# Altium schematic sheet MINIBLDC.SchDoc
size A4
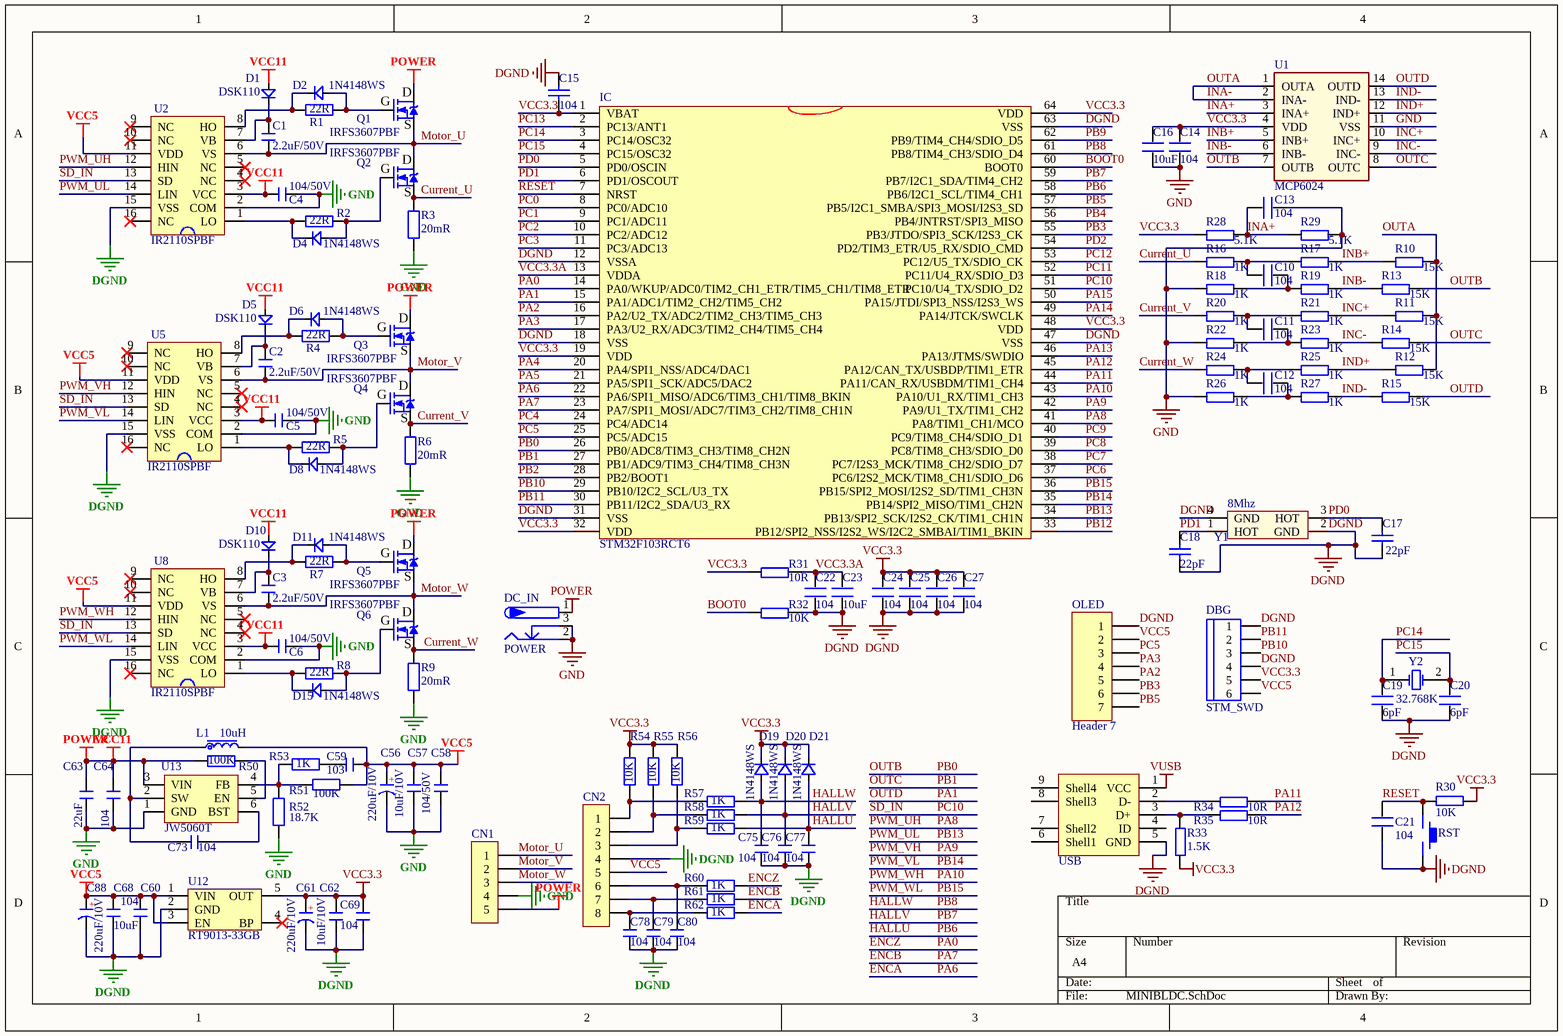
[diagram p0: MINIBLDC.SchDoc]

## Parts
C1  2.2uF/50V  [C 0603]
C2  2.2uF/50V  [C 0603]
C3  2.2uF/50V  [C 0603]
C4  104/50V  [C 0603]
C5  104/50V  [C 0603]
C6  104/50V  [C 0603]
C10  104  [C 0603]
C11  104  [C 0603]
C12  104  [C 0603]
C13  104  [C 0603]
C14  104  [C 0603]
C15  104  [C 0603]
C16  10uF  [C 0603]
C17  22pF  [C 0603]
C18  22pF  [C 0603]
C19  6pF  [C 0603]
C20  6pF  [C 0603]
C21  104  [C 0603]
C22  104  [C 0603]
C23  10uF  [C 0603]
C24  104  [C 0603]
C25  104  [C 0603]
C26  104  [C 0603]
C27  104  [C 0603]
C56  220uF/10V  [CM D(6.3*5.4)]
C57  10uF/10V  [C 0603]
C58  104/50V  [C 0603]
C59  103  [C 0603]
C60  104  [C 0603]
C61  220uF/10V  [CM D(6.3*5.4)]
C62  10uF/10V  [C 0603]
C63  22uF  [C 0805]
C64  104  [C 0603]
C68  10uF  [C 0603]
C69  104  [C 0603]
C73  104  [C 0603]
C75  104  [C 0603]
C76  104  [C 0603]
C77  104  [C 0603]
C78  104  [C 0603]
C79  104  [C 0603]
C80  104  [C 0603]
C88  220uF/10V  [CM D(6.3*5.4)]
CN1  HDR-1X5  [KF7620-5P]  (value not drawn)
CN2  HDR-1X8  [HDR2.54-LI-8P]  (value not drawn)
D1  DSK110  [SOD-123F]
D2  1N4148WS  [SOD-323]
D4  1N4148WS  [SOD-323]
D5  DSK110  [SOD-123F]
D6  1N4148WS  [SOD-323]
D8  1N4148WS  [SOD-323]
D10  DSK110  [SOD-123F]
D11  1N4148WS  [SOD-323]
D15  1N4148WS  [SOD-323]
D19  1N4148WS  [SOD-323]
D20  1N4148WS  [SOD-323]
D21  1N4148WS  [SOD-323]
DBG  STM_SWD  [SH1.0-6P]
DC_IN  POWER  [DC10B]
IC  STM32F103RCT6  [LQFP64-10*10]
L1  10uH  [L-SMD-0420]
OLED  Header 7  [HDR2.54-M-LI-7P]
Q1  IRFS3607PBF  [TO263-3B]
Q2  IRFS3607PBF  [TO263-3B]
Q3  IRFS3607PBF  [TO263-3B]
Q4  IRFS3607PBF  [TO263-3B]
Q5  IRFS3607PBF  [TO263-3B]
Q6  IRFS3607PBF  [TO263-3B]
R1  22R  [R 0603]
R2  22R  [R 0603]
R3  20mR  [R 2512_L]
R4  22R  [R 0603]
R5  22R  [R 0603]
R6  20mR  [R 2512_L]
R7  22R  [R 0603]
R8  22R  [R 0603]
R9  20mR  [R 2512_L]
R10  15K  [R 0603]
R11  15K  [R 0603]
R12  15K  [R 0603]
R13  15K  [R 0603]
R14  15K  [R 0603]
R15  15K  [R 0603]
R16  1K  [R 0603]
R17  1K  [R 0603]
R18  1K  [R 0603]
R19  1K  [R 0603]
R20  1K  [R 0603]
R21  1K  [R 0603]
R22  1K  [R 0603]
R23  1K  [R 0603]
R24  1K  [R 0603]
R25  1K  [R 0603]
R26  1K  [R 0603]
R27  1K  [R 0603]
R28  5.1K  [R 0603]
R29  5.1K  [R 0603]
R30  10K  [R 0603]
R31  10R  [R 0603]
R32  10K  [R 0603]
R33  1.5K  [R 0603]
R34  10R  [R 0603]
R35  10R  [R 0603]
R50  100K  [R 0603]
R51  100K  [R 0603]
R52  18.7K  [R 0603]
R53  1K  [R 0603]
R54  10K  [R 0603]
R55  10K  [R 0603]
R56  10K  [R 0603]
R57  1K  [R 0603]
R58  1K  [R 0603]
R59  1K  [R 0603]
R60  1K  [R 0603]
R61  1K  [R 0603]
R62  1K  [R 0603]
RST  KEY-SMD  [TSW SMD-3*6*2.5]  (value not drawn)
U1  MCP6024  [SOP14_L]
U2  IR2110SPBF  [SOP16W_L]
U5  IR2110SPBF  [SOP16W_L]
U8  IR2110SPBF  [SOP16W_L]
U12  RT9013-33GB  [SOT23-5N]
U13  JW5060T  [SOT23-6L]
USB  MICRO-USB  [USB-AB-5S]  (value not drawn)
Y1  8Mhz  [XTAL-3225]
Y2  32.768K  [OSC 3215-2P]

## Nets
DGND: C15.1 C17.1 C18.1 C19.1 C20.1 C21.1 C22.1 C23.1 C24.1 C25.1 C26.1 C27.1 C60.2 C61.2(K) C62.2 C68.2 C69.2 C75.2 C76.2 C77.2 C78.2 C79.2 C80.2 C88.2(K) CN2.4 DBG.1 DBG.4 IC.12(VSSA) IC.18(VSS) IC.31(VSS) IC.47(VSS) IC.63(VSS) OLED.1 R32.2 RST.2 U2.15(VSS) U5.15(VSS) U8.15(VSS) U12.2(GND) USB.5(GND) Y1.2(GND) Y1.4(GND)
GND: C4.1 C5.1 C6.1 C13.2 C14.1 C16.1 C56.2(K) C57.2 C58.2 C63.2 C64.2 CN1.4 DC_IN.2 DC_IN.3 R3.1 R6.1 R9.1 R18.1 R22.1 R26.1 R29.2 R52.2 U1.11(VSS) U2.2(COM) U5.2(COM) U8.2(COM) U13.1(GND)
POWER: C4.2 C5.2 C6.2 C63.1 C64.1 CN1.5 D1.1(A) D5.1(A) D10.1(A) DC_IN.1 Q1.2(D) Q3.2(D) Q5.2(D) R50.1 U2.3(VCC) U5.3(VCC) U8.3(VCC) U13.3(VIN)  [also labelled VCC11]
VCC3.3: C14.2 C15.2 C16.2 C24.2 C25.2 C26.2 C27.2 C61.1(A) C62.1 C69.1 D19.2(K) D20.2(K) D21.2(K) DBG.5 IC.1(VBAT) IC.19(VDD) IC.32(VDD) IC.48(VDD) IC.64(VDD) R28.1 R30.1 R31.1 R33.1 R54.1 R55.1 R56.1 U1.4(VDD) U12.5(OUT)
VCC5: C56.1(A) C57.1 C58.1 C59.2 C60.1 C68.1 C88.1(A) CN2.5 DBG.6 L1.2 OLED.2 R51.2 U2.11(VDD) U5.11(VDD) U8.11(VDD) U12.1(VIN) U12.3(EN)
VUSB: USB.1(VCC)
BOOT0: IC.60(BOOT0) R32.1
Current_U: Q2.3(S) R3.2 R16.1
Current_V: Q4.3(S) R6.2 R20.1
Current_W: Q6.3(S) R9.2 R24.1
ENCA: IC.22(PA6/SPI1_MISO/ADC6/TIM3_CH1/TIM8_BKIN) R62.2  [also labelled PA6]
ENCB: IC.23(PA7/SPI1_MOSI/ADC7/TIM3_CH2/TIM8_CH1N) R61.2  [also labelled PA7]
ENCZ: IC.14(PA0/WKUP/ADC0/TIM2_CH1_ETR/TIM5_CH1/TIM8_ETR) R60.2  [also labelled PA0]
HALLU: C77.1 D21.1(A) IC.58(PB6/I2C1_SCL/TIM4_CH1) R59.2  [also labelled PB6]
HALLV: C76.1 D20.1(A) IC.59(PB7/I2C1_SDA/TIM4_CH2) R58.2  [also labelled PB7]
HALLW: C75.1 D19.1(A) IC.61(PB8/TIM4_CH3/SDIO_D4) R57.2  [also labelled PB8]
INA+: C13.1 R28.2 R29.1 U1.3(INA+)
INA-: R10.2 R11.2 R12.2 U1.1(OUTA) U1.2(INA-)  [also labelled OUTA]
INB+: R10.1 R17.2 U1.5(INB+)
INB-: R13.1 R19.2 U1.6(INB-)
INC+: R11.1 R21.2 U1.10(INC+)
INC-: R14.1 R23.2 U1.9(INC-)
IND+: R12.1 R25.2 U1.12(IND+)
IND-: R15.1 R27.2 U1.13(IND-)
Motor_U: C1.1 CN1.1 Q1.3(S) Q2.2(D) U2.6(VS)
Motor_V: C2.1 CN1.2 Q3.3(S) Q4.2(D) U5.6(VS)
Motor_W: C3.1 CN1.3 Q5.3(S) Q6.2(D) U8.6(VS)
OUTB: IC.26(PB0/ADC8/TIM3_CH3/TIM8_CH2N) R13.2 U1.7(OUTB)  [also labelled PB0]
OUTC: IC.27(PB1/ADC9/TIM3_CH4/TIM8_CH3N) R14.2 U1.8(OUTC)  [also labelled PB1]
OUTD: IC.15(PA1/ADC1/TIM2_CH2/TIM5_CH2) R15.2 U1.14(OUTD)  [also labelled PA1]
PA2: IC.16(PA2/U2_TX/ADC2/TIM2_CH3/TIM5_CH3) OLED.5
PA3: IC.17(PA3/U2_RX/ADC3/TIM2_CH4/TIM5_CH4) OLED.4
PA4: IC.20(PA4/SPI1_NSS/ADC4/DAC1)
PA5: IC.21(PA5/SPI1_SCK/ADC5/DAC2)
PA8: IC.41(PA8/TIM1_CH1/MCO) U2.12(HIN)  [also labelled PWM_UH]
PA9: IC.42(PA9/U1_TX/TIM1_CH2) U5.12(HIN)  [also labelled PWM_VH]
PA10: IC.43(PA10/U1_RX/TIM1_CH3) U8.12(HIN)  [also labelled PWM_WH]
PA11: IC.44(PA11/CAN_RX/USBDM/TIM1_CH4) R34.2
PA12: IC.45(PA12/CAN_TX/USBDP/TIM1_ETR) R35.2
PA13: IC.46(PA13/JTMS/SWDIO)
PA14: IC.49(PA14/JTCK/SWCLK)
PA15: IC.50(PA15/JTDI/SPI3_NSS/I2S3_WS)
PB2: IC.28(PB2/BOOT1)
PB3: IC.55(PB3/JTDO/SPI3_SCK/I2S3_CK) OLED.6
PB4: IC.56(PB4/JNTRST/SPI3_MISO)
PB5: IC.57(PB5/I2C1_SMBA/SPI3_MOSI/I2S3_SD) OLED.7
PB9: IC.62(PB9/TIM4_CH4/SDIO_D5)
PB10: DBG.3 IC.29(PB10/I2C2_SCL/U3_TX)
PB11: DBG.2 IC.30(PB11/I2C2_SDA/U3_RX)
PB12: IC.33(PB12/SPI2_NSS/I2S2_WS/I2C2_SMBAI/TIM1_BKIN)
PB13: IC.34(PB13/SPI2_SCK/I2S2_CK/TIM1_CH1N) U2.14(LIN)  [also labelled PWM_UL]
PB14: IC.35(PB14/SPI2_MISO/TIM1_CH2N) U5.14(LIN)  [also labelled PWM_VL]
PB15: IC.36(PB15/SPI2_MOSI/I2S2_SD/TIM1_CH3N) U8.14(LIN)  [also labelled PWM_WL]
PC0: IC.8(PC0/ADC10)
PC1: IC.9(PC1/ADC11)
PC2: IC.10(PC2/ADC12)
PC3: IC.11(PC3/ADC13)
PC4: IC.24(PC4/ADC14)
PC5: IC.25(PC5/ADC15) OLED.3
PC6: IC.37(PC6/I2S2_MCK/TIM8_CH1/SDIO_D6)
PC7: IC.38(PC7/I2S3_MCK/TIM8_CH2/SDIO_D7)
PC8: IC.39(PC8/TIM8_CH3/SDIO_D0)
PC9: IC.40(PC9/TIM8_CH4/SDIO_D1)
PC10: IC.51(PC10/U4_TX/SDIO_D2) U2.13(SD) U5.13(SD) U8.13(SD)  [also labelled SD_IN]
PC11: IC.52(PC11/U4_RX/SDIO_D3)
PC12: IC.53(PC12/U5_TX/SDIO_CK)
PC13: IC.2(PC13/ANT1)
PC14: C19.2 IC.3(PC14/OSC32) Y2.1(OSC1)
PC15: C20.2 IC.4(PC15/OSC32) Y2.2(OSC2)
PD0: C17.2 IC.5(PD0/OSCIN) Y1.3(HOT)
PD1: C18.2 IC.6(PD1/OSCOUT) Y1.1(HOT)
PD2: IC.54(PD2/TIM3_ETR/U5_RX/SDIO_CMD)
RESET: C21.2 IC.7(NRST) R30.2 RST.1
VCC3.3A: C22.2 C23.2 IC.13(VDDA) R31.2
NetC1_2: C1.2 D1.2(K) U2.7(VB)
NetC2_2: C2.2 D5.2(K) U5.7(VB)
NetC3_2: C3.2 D10.2(K) U8.7(VB)
NetC10_1: C10.1 R16.2 R17.1
NetC10_2: C10.2 R18.2 R19.1
NetC11_1: C11.1 R20.2 R21.1
NetC11_2: C11.2 R22.2 R23.1
NetC12_1: C12.1 R24.2 R25.1
NetC12_2: C12.2 R26.2 R27.1
NetC59_1: C59.1 R53.2
NetC73_1: C73.1 U13.6(BST)
NetC73_2: C73.2 L1.1 U13.2(SW)
NetC78_1: C78.1 CN2.8 R62.1
NetC79_1: C79.1 CN2.7 R61.1
NetC80_1: C80.1 CN2.6 R60.1
NetCN2_1: CN2.1 R54.2 R57.1
NetCN2_2: CN2.2 R55.2 R58.1
NetCN2_3: CN2.3 R56.2 R59.1
NetD2_1: D2.1(A) Q1.1(G) R1.2
NetD2_2: D2.2(K) R1.1 U2.8(HO)
NetD4_1: D4.1(A) Q2.1(G) R2.2
NetD4_2: D4.2(K) R2.1 U2.1(LO)
NetD6_1: D6.1(A) Q3.1(G) R4.2
NetD6_2: D6.2(K) R4.1 U5.8(HO)
NetD8_1: D8.1(A) Q4.1(G) R5.2
NetD8_2: D8.2(K) R5.1 U5.1(LO)
NetD11_1: D11.1(A) Q5.1(G) R7.2
NetD11_2: D11.2(K) R7.1 U8.8(HO)
NetD15_1: D15.1(A) Q6.1(G) R8.2
NetD15_2: D15.2(K) R8.1 U8.1(LO)
NetR33_2: R33.2 R35.1 USB.3(D+)
NetR34_1: R34.1 USB.2(D-)
NetR50_2: R50.2 U13.5(EN)
NetR51_1: R51.1 R52.1 R53.1 U13.4(FB)

Not connected (* = marked no-connect by the designer): U2 4(NC)* 5(NC)* 9(NC)* 10(NC)* 16(NC)*; U5 4(NC)* 5(NC)* 9(NC)* 10(NC)* 16(NC)*; U8 4(NC)* 5(NC)* 9(NC)* 10(NC)* 16(NC)*; U12 4(BP)*; USB 4(ID) 6(Shell1) 7(Shell2) 8(Shell3) 9(Shell4)

## Notes on the sheet
- (in symbol C-CM) +

## Library data of the parts
C1-C6 C57-C60 C62-C64 C68 C69 C73 C75-C80 = C: 无极性贴片电容; 版权归属: 源创客; BOM名称: 无极性贴片电容; 学习资源: www.ooocke.com
C10-C14 C16 C19-C27 = C
C15 C17 C18 = CAP
C56 C61 C88 = C-CM: 贴片电解电容; 版权归属: 源创客; BOM名称: 贴片电解电容; 学习资源: www.ooocke.com
CN1 = Header 5: 5P接插件; 版权归属: 源创客; BOM名称: 5P接插件; 学习资源: www.ooocke.com
CN2 = Header 8: 8P接插件; 版权归属: 源创客; BOM名称: 8P接插件; 学习资源: www.ooocke.com
D1 D5 D10 = DSK110: 通用二极管 100V-1A; BOM名称: 快恢复二极管; 版权归属: 源创客; 属性: 700V/1A
D2 D4 D6 D8 D11 D15 = FR107: 通用二极管 700V-1A; BOM名称: 快恢复二极管; 版权归属: 源创客; 属性: 700V/1A
D19-D21 = RS1M: 通用二极管 1000V-1A; BOM名称: 肖特基二极管; 版权归属: 源创客; 属性: 40V/1A; 学习资源: www.ooocke.com
DBG = HEAD6
DC_IN = P-DC: 低压电源接口; BOM名称: DC电源接口; 版权归属: 源创客; 学习资源: www.ooocke.com
IC = STM32F103RDT6
L1 = L-CDRH: 功率屏蔽电感; 版权归属: 源创客; BOM名称: 功率屏蔽电感; 学习资源: www.ooocke.com
OLED = Header 7: Header, 7-Pin; LatestRevisionDate: 17-Jul-2002; LatestRevisionNote: Re-released for DXP Platform.; Publisher: Altium Limited
Q1-Q6 = IRFS3607PBF: NMOS 75V+80A 7.4mΩ; BOM名称: N沟场效应管; 版权归属: 源创客; 学习资源: www.ooocke.com
R1-R9 R50-R62 = R: 贴片电阻; 版权归属: 源创客; BOM名称: 贴片电阻; 学习资源: www.ooocke.com
R10-R35 = R
RST = S-KEY-SMD-324225: KEY,SMD,324225
U2 U5 U8 = IR2110SPBF: 半桥驱动 500V,10-20V  Ton/off=120ns&94ns MT=10nS
U12 = LDO RT9193: LDO; BOM名称: 稳压芯片; 版权归属: 源创客; 学习资源: www.ooocke.com
U13 = DC JW5060T_6: DC降压芯片
USB = J-MICRO-USB-5S: Micro USB 5.9有柱脚长1.25加长针
Y1 = XTAL_3225: 3225贴片无源晶振
Y2 = XTAL: Crystal Oscillator; Published: 8-Jun-2000; LatestRevisionDate: 17-Jul-2002; LatestRevisionNote: Re-released for DXP Platform.; Publisher: Altium Limited